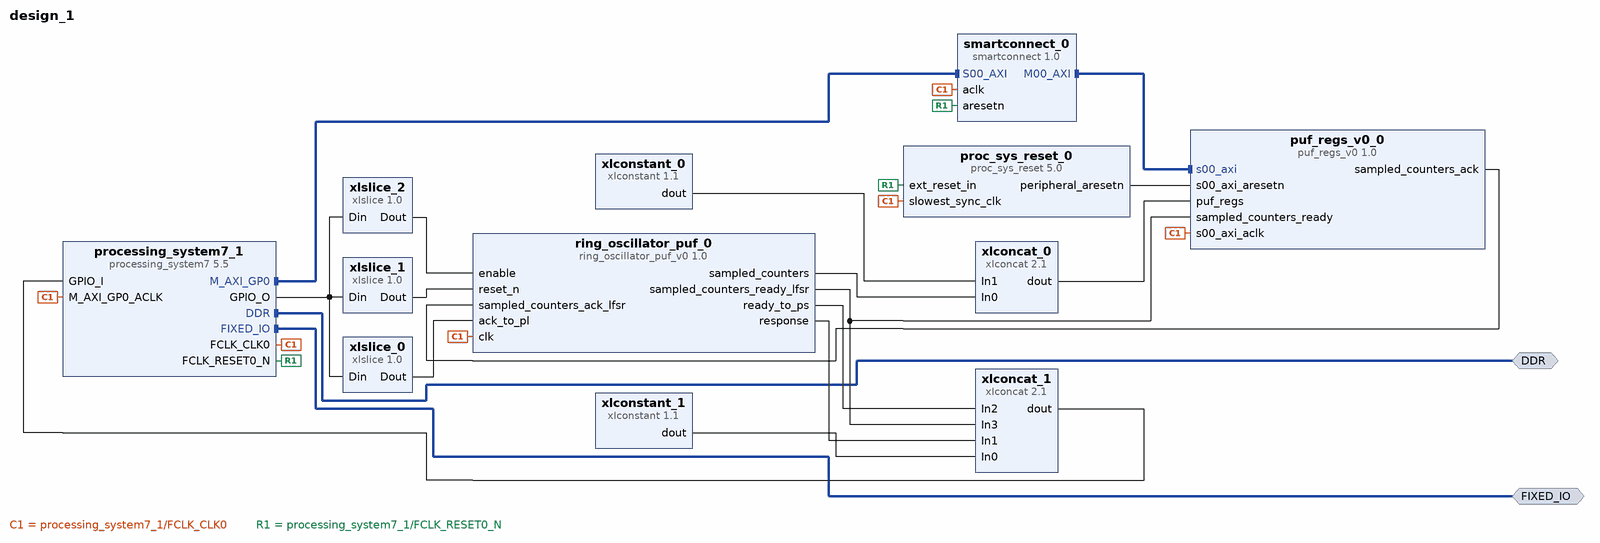
[diagram p0: block diagram of the top level]
# Vivado block design design_1, xc7z020clg400-1, Vivado 2022.1
create_bd_design design_1

create_bd_intf_port -mode Master -vlnv xilinx.com:interface:ddrx_rtl:1.0 DDR
create_bd_intf_port -mode Master -vlnv xilinx.com:display_processing_system7:fixedio_rtl:1.0 FIXED_IO

create_bd_cell -type ip -vlnv xilinx.com:ip:xlslice:1.0 xlslice_0
set_property -dict {CONFIG.DIN_WIDTH 13} [get_bd_cells xlslice_0]
create_bd_cell -type ip -vlnv xilinx.com:ip:xlslice:1.0 xlslice_1
set_property -dict {CONFIG.DIN_FROM 1 CONFIG.DIN_TO 1 CONFIG.DIN_WIDTH 13 CONFIG.DOUT_WIDTH 1} [get_bd_cells xlslice_1]
create_bd_cell -type ip -vlnv xilinx.com:ip:xlslice:1.0 xlslice_2
set_property -dict {CONFIG.DIN_FROM 2 CONFIG.DIN_TO 2 CONFIG.DIN_WIDTH 13 CONFIG.DOUT_WIDTH 1} [get_bd_cells xlslice_2]
create_bd_cell -type ip -vlnv xilinx.com:ip:xlconcat:2.1 xlconcat_0
create_bd_cell -type ip -vlnv xilinx.com:ip:xlconstant:1.1 xlconstant_0
set_property -dict {CONFIG.CONST_VAL 0 CONFIG.CONST_WIDTH 704} [get_bd_cells xlconstant_0]
create_bd_cell -type ip -vlnv xilinx.com:ip:xlconcat:2.1 xlconcat_1
set_property -dict {CONFIG.NUM_PORTS 4} [get_bd_cells xlconcat_1]
create_bd_cell -type ip -vlnv xilinx.com:ip:proc_sys_reset:5.0 proc_sys_reset_0
create_bd_cell -type ip -vlnv xilinx.com:ip:xlconstant:1.1 xlconstant_1
set_property -dict {CONFIG.CONST_VAL 0 CONFIG.CONST_WIDTH 3} [get_bd_cells xlconstant_1]
create_bd_cell -type ip -vlnv user.com:user:ring_oscillator_puf_v0:1.0 ring_oscillator_puf_0
set_property -dict [list \
  CONFIG.g_clk_freq 25000000 \
  CONFIG.g_timer_comparator_eoc 200000 \
  CONFIG.g_timer_lfsr_seed_eoc 200000 \
] [get_bd_cells ring_oscillator_puf_0]
create_bd_cell -type ip -vlnv xilinx.com:ip:smartconnect:1.0 smartconnect_0
set_property -dict {CONFIG.NUM_SI 1} [get_bd_cells smartconnect_0]
create_bd_cell -type ip -vlnv xilinx.com:ip:processing_system7:5.5 processing_system7_1
set_property -dict [list \
  CONFIG.PCW_CRYSTAL_PERIPHERAL_FREQMHZ 50 \
  CONFIG.PCW_FPGA0_PERIPHERAL_FREQMHZ 25 \
  CONFIG.PCW_GPIO_EMIO_GPIO_ENABLE 1 \
  CONFIG.PCW_GPIO_EMIO_GPIO_IO 13 \
  CONFIG.PCW_GPIO_EMIO_GPIO_WIDTH 13 \
] [get_bd_cells processing_system7_1]
# 31 more settings of processing_system7_1 are not shown: defaults, MIO pin electricals, DDR timing, and values the tool derives
create_bd_cell -type ip -vlnv user.com:user:puf_regs_v0:1.0 puf_regs_v0_0

# ---- connections ----

connect_bd_intf_net [get_bd_intf_ports DDR] [get_bd_intf_pins processing_system7_1/DDR]
connect_bd_intf_net [get_bd_intf_ports FIXED_IO] [get_bd_intf_pins processing_system7_1/FIXED_IO]
connect_bd_intf_net [get_bd_intf_pins processing_system7_1/M_AXI_GP0] [get_bd_intf_pins smartconnect_0/S00_AXI]
connect_bd_intf_net [get_bd_intf_pins smartconnect_0/M00_AXI] [get_bd_intf_pins puf_regs_v0_0/s00_axi]
connect_bd_net [get_bd_pins proc_sys_reset_0/peripheral_aresetn] [get_bd_pins puf_regs_v0_0/s00_axi_aresetn]
connect_bd_net [get_bd_pins processing_system7_1/FCLK_CLK0] \
  [get_bd_pins smartconnect_0/aclk] [get_bd_pins proc_sys_reset_0/slowest_sync_clk] [get_bd_pins ring_oscillator_puf_0/clk] \
  [get_bd_pins processing_system7_1/M_AXI_GP0_ACLK] [get_bd_pins puf_regs_v0_0/s00_axi_aclk]
connect_bd_net [get_bd_pins processing_system7_1/FCLK_RESET0_N] [get_bd_pins smartconnect_0/aresetn] [get_bd_pins proc_sys_reset_0/ext_reset_in]
connect_bd_net [get_bd_pins processing_system7_1/GPIO_O] [get_bd_pins xlslice_0/Din] [get_bd_pins xlslice_1/Din] [get_bd_pins xlslice_2/Din]
connect_bd_net [get_bd_pins puf_regs_v0_0/sampled_counters_ack] [get_bd_pins ring_oscillator_puf_0/sampled_counters_ack_lfsr]
connect_bd_net [get_bd_pins ring_oscillator_puf_0/ready_to_ps] [get_bd_pins xlconcat_1/In2]
connect_bd_net [get_bd_pins ring_oscillator_puf_0/response] [get_bd_pins xlconcat_1/In1]
connect_bd_net [get_bd_pins ring_oscillator_puf_0/sampled_counters] [get_bd_pins xlconcat_0/In0]
connect_bd_net [get_bd_pins ring_oscillator_puf_0/sampled_counters_ready_lfsr] \
  [get_bd_pins xlconcat_1/In3] [get_bd_pins puf_regs_v0_0/sampled_counters_ready]
connect_bd_net [get_bd_pins xlconcat_0/dout] [get_bd_pins puf_regs_v0_0/puf_regs]
connect_bd_net [get_bd_pins xlconcat_1/dout] [get_bd_pins processing_system7_1/GPIO_I]
connect_bd_net [get_bd_pins xlconstant_0/dout] [get_bd_pins xlconcat_0/In1]
connect_bd_net [get_bd_pins xlconstant_1/dout] [get_bd_pins xlconcat_1/In0]
connect_bd_net [get_bd_pins xlslice_0/Dout] [get_bd_pins ring_oscillator_puf_0/ack_to_pl]
connect_bd_net [get_bd_pins xlslice_1/Dout] [get_bd_pins ring_oscillator_puf_0/reset_n]
connect_bd_net [get_bd_pins xlslice_2/Dout] [get_bd_pins ring_oscillator_puf_0/enable]

# ---- address map ----
assign_bd_address -offset 0x40000000 -range 4K -target_address_space [get_bd_addr_spaces processing_system7_1/Data] [get_bd_addr_segs puf_regs_v0_0/s00_axi/reg0]

validate_bd_design
save_bd_design
